# EAGLE design MRA12 (EAGLE 5.11)
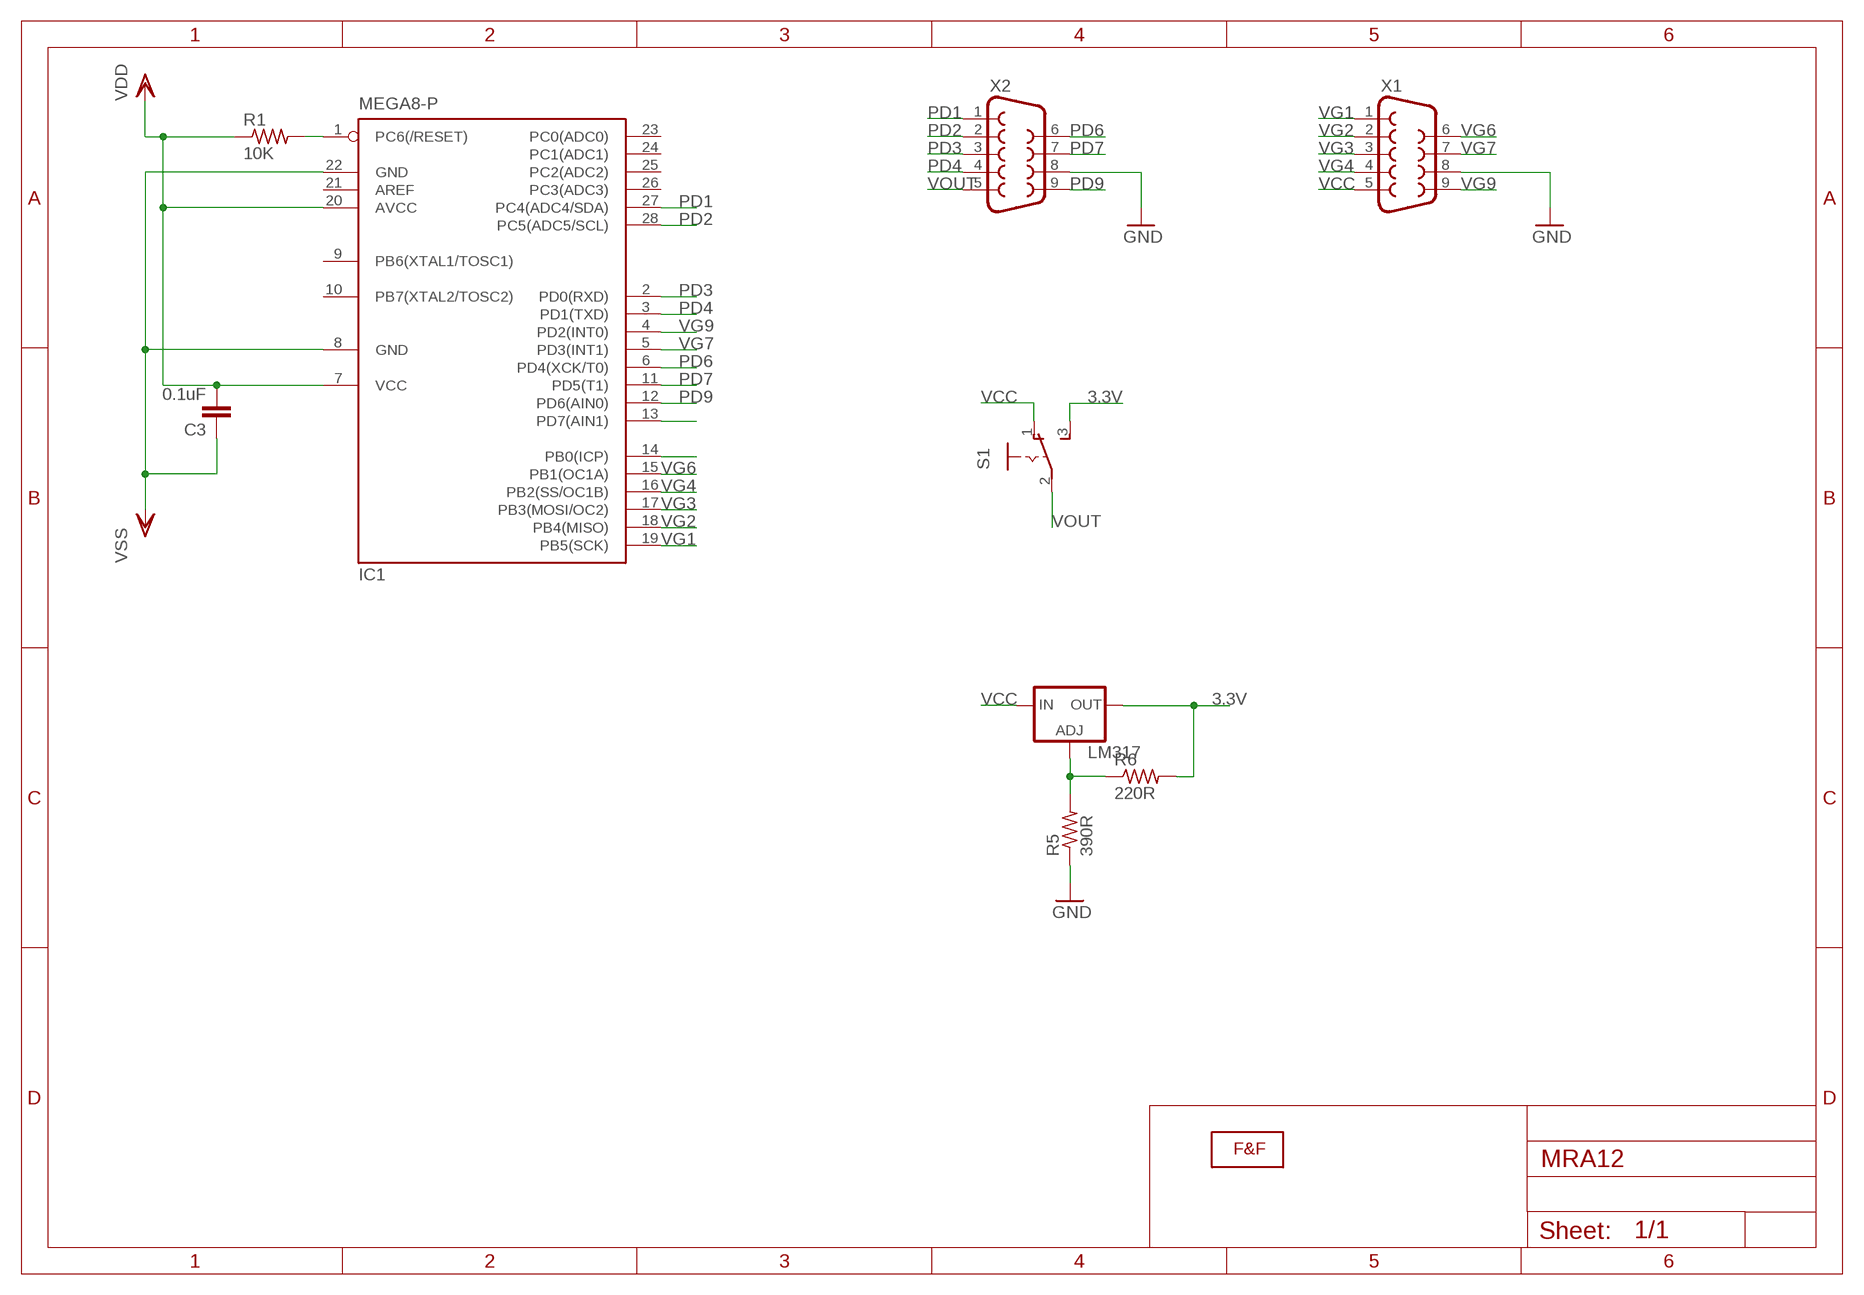
[diagram p0: schematic, sheet 1]

## Parts
C3  0.1uF  C-EU050-024X044  [C050-024X044]
IC1  MEGA8-P  [DIL28-3]
LM317  LM317TS  [317TS]
R1  10K  R-US_0207/10  [0207/10]
R5  390R  R-US_0207/10  [0207/10]
R6  220R  R-US_0207/10  [0207/10]
S1  CHAVE  [CHAVE]
U$1  LOGOLOGO_WITHOUT_SMOKE_SMALL  [LOGO2_SMALL]
X1  DB9MALE  [DB9_MALE]
X2  DB9MALE  [DB9_MALE]

## Nets
3.3V: LM317.2(OUT) R6.2 S1.3(S)
GND: C3.1 IC1.8(GND) IC1.22(GND) R5.1 X1.8 X2.8 ; supply symbol labelled VSS
N$1: IC1.1(PC6(/RESET)) R1.2
N$2: IC1.13(PD7(AIN1))
N$4: IC1.14(PB0(ICP))
N$5: LM317.1(ADJ) R5.2 R6.1
PD1: IC1.27(PC4(ADC4/SDA)) X2.1
PD2: IC1.28(PC5(ADC5/SCL)) X2.2
PD3: IC1.2(PD0(RXD)) X2.3
PD4: IC1.3(PD1(TXD)) X2.4
PD6: IC1.6(PD4(XCK/T0)) X2.6
PD7: IC1.11(PD5(T1)) X2.7
PD9: IC1.12(PD6(AIN0)) X2.9
VCC: LM317.3(IN) S1.1(O) X1.5
VG1: IC1.19(PB5(SCK)) X1.1
VG2: IC1.18(PB4(MISO)) X1.2
VG3: IC1.17(PB3(MOSI/OC2)) X1.3
VG4: IC1.16(PB2(SS/OC1B)) X1.4
VG6: IC1.15(PB1(OC1A)) X1.6
VG7: IC1.5(PD3(INT1)) X1.7
VG9: IC1.4(PD2(INT0)) X1.9
VOUT: C3.2 IC1.7(VCC) IC1.20(AVCC) R1.1 S1.2(P) X2.5 ; supply symbol labelled VDD
Unconnected: IC1.9(PB6(XTAL1/TOSC1)) IC1.10(PB7(XTAL2/TOSC2)) IC1.21(AREF) IC1.23(PC0(ADC0)) IC1.24(PC1(ADC1)) IC1.25(PC2(ADC2)) IC1.26(PC3(ADC3))

## Library data of the parts
C3 = rcl:C-EU: CAPACITOR, European symbol
IC1 = atmel:MEGA8-P: MICROCONTROLLER 8 Kbytes FLASH, 1 kbytes SRAM, 512 bytes EEPROM, USART, 4-channel 10 bit ADC, 2-channel 8 bit ADC Pin compatible with Atmega48, ATMega88, ATMega168 Source: avr.lbr; OC_FARNELL: unknown; OC_NEWARK: unknown
LM317 = v-reg:LM317TS: VOLTAGE REGULATOR
R1 R5 R6 = adafruit:R-US_: RESISTOR, American symbol
S1 = switch-fef:CHAVE: chave Verificar
U$1 = F&F:LOGO: Faísca e Fumaça Logo faiscaefumaca.com.br
X1 X2 = SparkFun:DB9: DB9 Connector Standard DB9 (D-Sub 9) serial connector. Can be used for CAN bus as well as RS485 and RS232. Footprint production proven. Spark Fun Electronics SKU : PRT-00429

## Board
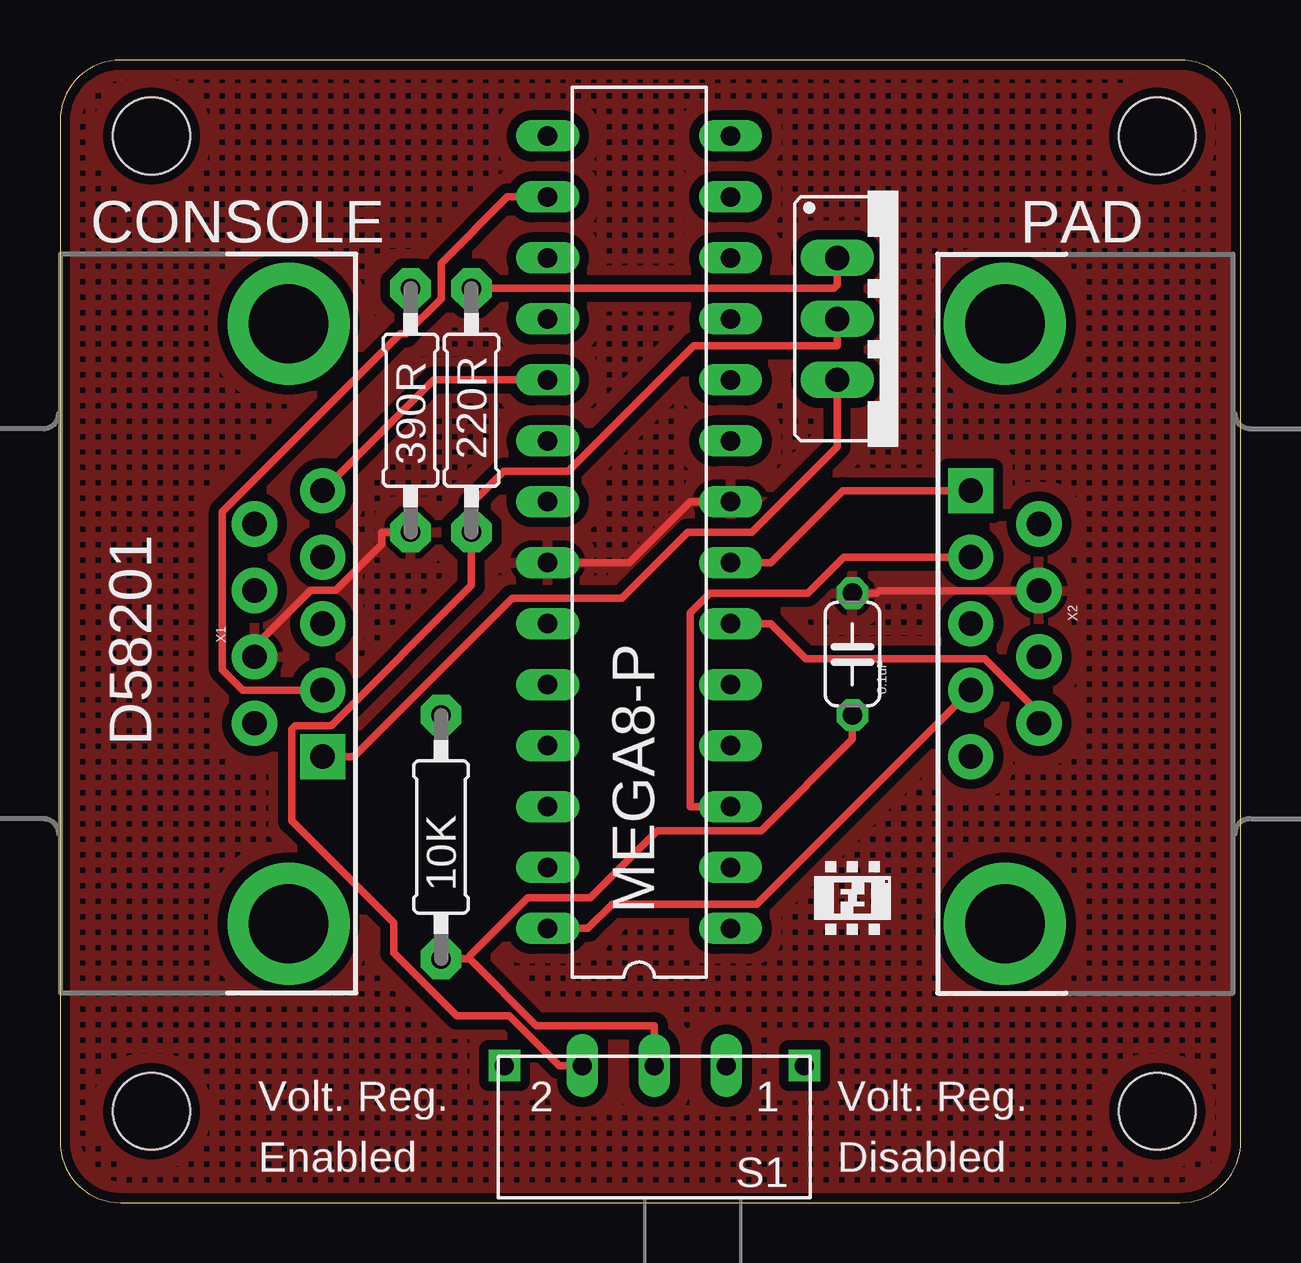
[diagram p1: board, top side]
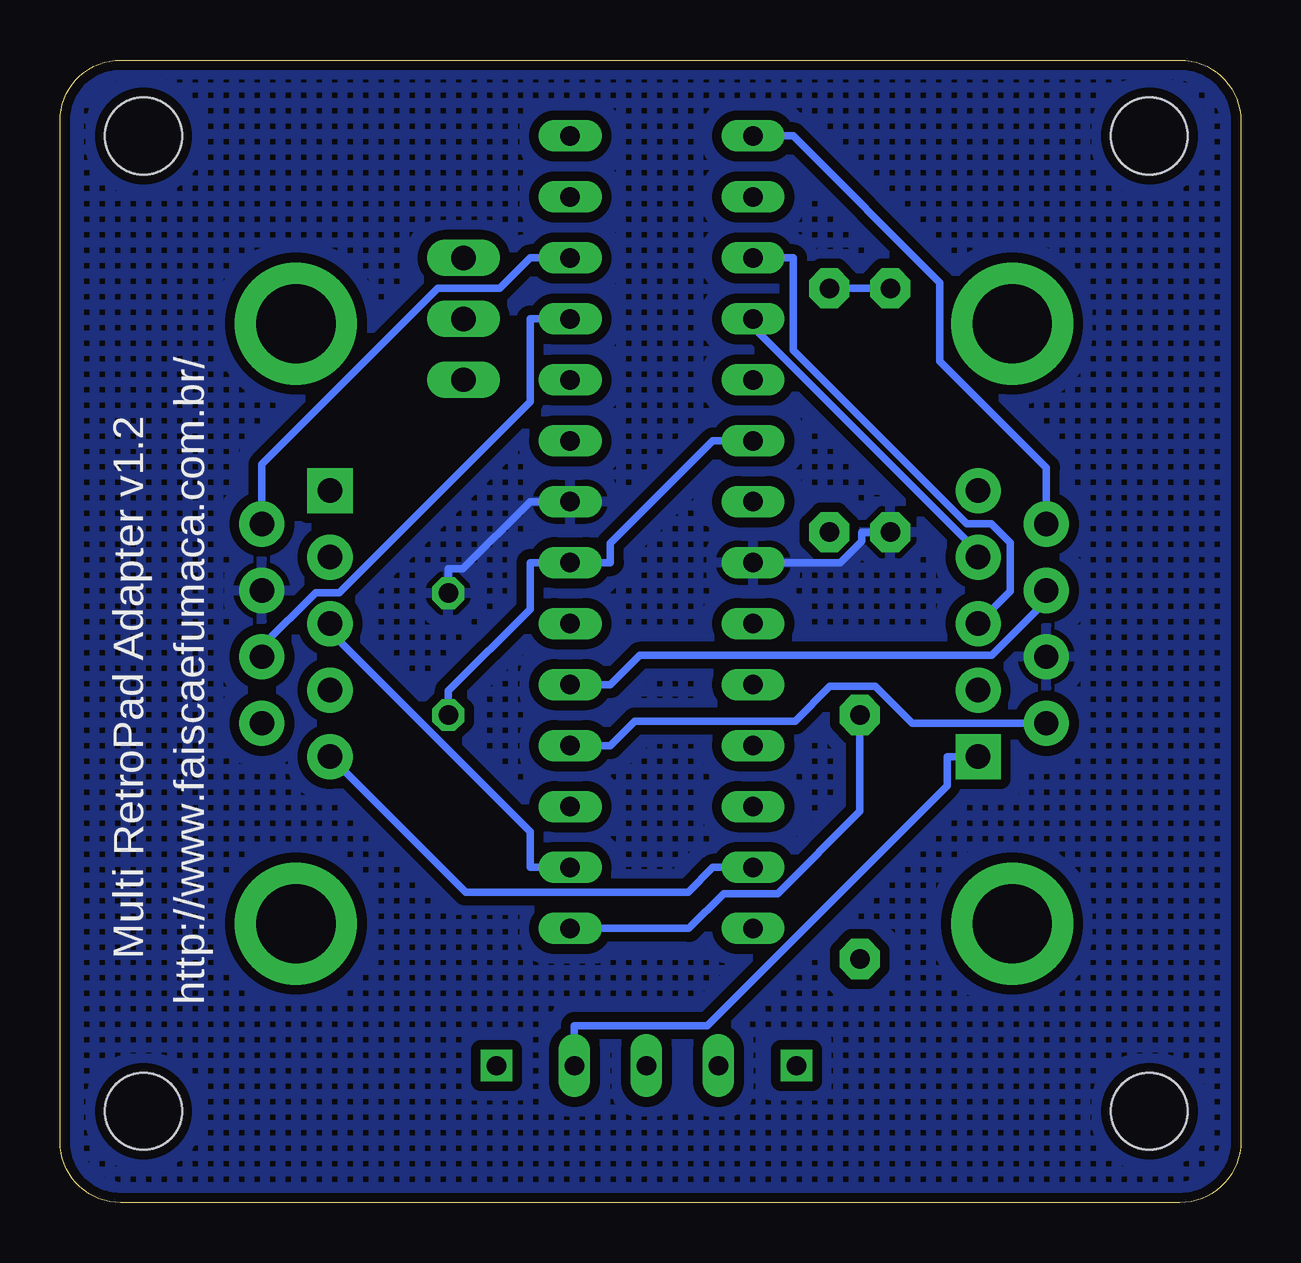
[diagram p2: board, bottom side, seen from below]

Size 49.2 x 47.62 mm. Coordinates in mm from the lower left corner, seen from the top.
Outline: 49.2,45.08 arc90 46.66,47.62 2.54,47.62 arc90 0,45.08 0,2.54 arc90 2.54,0 46.66,0 arc90 49.2,2.54 49.2,45.08
Copper layers (1*16): Top 0.035mm / dielectric 1.5mm / Bottom 0.035mm
Design rules "Fusion_eagle_rule_v1.1": minimum track width 6mil, minimum drill 12mil, track to track 6mil, track to pad 6mil, pad to pad 6mil, via to via 6mil, smd to smd 0mil, copper to edge 10mil, drill to drill 10mil, minimum pad ring 10mil, minimum via ring 6mil, stop-mask expansion 2mil, vias tented up to drill 100mil, thermal gap 10mil
Holes 3.2 mm at 3.81,44.45 3.81,3.81 45.72,44.45 45.72,3.81

### Footprints (pad centres in the part's own frame; a part is rotated, then mirrored left to right if it is on the bottom)
C050-024X044 = drill 0.813 octagon: 1 -2.54,0; 2 2.54,0
DIL28-3 = drill 0.813 long: 1 -16.51,-3.81; 2 -13.97,-3.81; 3 -11.43,-3.81; 4 -8.89,-3.81; 5 -6.35,-3.81; 6 -3.81,-3.81; 7 -1.27,-3.81; 8 1.27,-3.81; 9 3.81,-3.81; 10 6.35,-3.81; 11 8.89,-3.81; 12 11.43,-3.81; 13 13.97,-3.81; 14 16.51,-3.81; 15 16.51,3.81; 16 13.97,3.81; 17 11.43,3.81; 18 8.89,3.81; 19 6.35,3.81; 20 3.81,3.81; 21 1.27,3.81; 22 -1.27,3.81; 23 -3.81,3.81; 24 -6.35,3.81; 25 -8.89,3.81; 26 -11.43,3.81; 27 -13.97,3.81; 28 -16.51,3.81
317TS = drill 1.016 long: 1 -2.54,-2.54; 2 0,-2.54; 3 2.54,-2.54
0207/10 = drill 0.813 pad 1.676 octagon: 1 -5.08,0; 2 5.08,0
CHAVE = drill 0.8 long: 1 -3,0; 2 0,0; 3 3,0 | drill 0.8 square: P$1 -6.25,0; P$2 6.25,0
DB9_MALE = drill 1.016 pad 1.88 round: 1 5.54,-1.42; 2 2.77,-1.42; 3 0,-1.42; 4 -2.77,-1.42; 6 4.15,1.42; 7 1.38,1.42; 8 -1.38,1.42; 9 -4.15,1.42 | drill 1.016 pad 1.88 square: 5 -5.54,-1.42 | drill 3.302 pad 5.08 round: G1 -12.5,0; G2 12.5,0

### Placement (x,y rotation side)
C3  33.02,22.86 270 top
IC1  24.13,27.94 90 top
LM317  34.92,36.83 270 top
R1  15.88,15.24 90 top
R5  14.61,33.02 90 top
R6  17.14,33.02 270 top
S1  24.77,5.71 180 top
U$1  33.02,12.7 0 top
X1  9.53,24.13 90 top
X2  39.37,24.13 270 top

### Tracks (layer width: path | path; a pad name or v marks a point on that pad's centre or on a via)
3.3V
  Top 0.305: S1.3 20.8,5.71 18.73,7.79 16.54,7.79 13.9,10.43 13.9,11.66 9.65,15.91 9.65,19.72 9.81,19.89 11.31,19.89 17.14,25.73 R6.2 17.14,29.13 18.49,30.48 21.17,30.48 26.4,35.71 32.38,35.71 LM317.2
GND
  Top 0.305: IC1.8 26.26,29.21 23.72,26.67 IC1.22 | R5.1 13.41,27.94 13.41,27.45 11.48,25.52 10.44,25.52 8.11,23.18 X1.8 | C3.1 34.04,25.4 34.15,25.51 X2.8
  Bottom 0.305: R5.1 15.8,27.94 15.8,27.57 16.7,26.67 IC1.22 | C3.1 33.02,26.42 32.41,26.42 29.62,29.21 IC1.8
  pour Top (isolate 0.406, hatched): 0,48.26 49.53,48.26 49.53,0 0,0
  pour Bottom (isolate 0.406, hatched): 0,48.26 49.53,48.26 49.53,0 0,0
N$1
  Bottom 0.305: R1.2 15.88,16.31 19.3,12.88 21.55,12.88 23,11.43 IC1.1
N$5
  Top 0.305: LM317.1 32.38,38.25 32.23,38.1 R6.1
  Bottom 0.305: R5.2 R6.1
PD1
  Bottom 0.305: IC1.27 22,13.97 23.03,12.94 32.3,12.94 X2.1
PD2
  Top 0.305: IC1.28 22,11.43 23.01,12.45 29.04,12.45 X2.2
PD3
  Bottom 0.305: IC1.2 29.62,13.97 29.62,15.46 37.95,23.79 X2.3
PD4
  Top 0.305: IC1.3 26.26,16.51 26.26,24.58 27.08,25.4 31.15,25.4 32.65,26.9 X2.4
PD6
  Top 0.305: IC1.6 29.62,24.13 31.08,22.67 38.53,22.67 40.79,20.41 X2.6
PD7
  Bottom 0.305: IC1.11 29.62,36.83 29.62,33.38 37.57,25.43 38.55,25.43 40.79,23.18 X2.7
PD9
  Bottom 0.305: IC1.12 29.62,39.37 30.89,38.1 33.46,38.1 40.79,30.77 X2.9
VCC
  Top 0.305: LM317.3 32.38,31.49 28.83,27.94 26.16,27.94 23.41,25.19 18.84,25.19 12.24,18.59 X1.5
  Bottom 0.305: S1.1 27.77,7.38 22.24,7.38 12.24,17.38 12.24,18.59 X1.5
VG1
  Top 0.305: X1.1 15.56,34.29 IC1.19
VG2
  Bottom 0.305: X1.2 10.95,27.1 20.32,36.47 IC1.18
VG3
  Bottom 0.305: IC1.17 18.64,39.37 18.64,35.52 11.41,28.29 10.39,28.29 9.6,27.5 9.6,25.47 X1.3
VG4
  Top 0.305: IC1.16 18.64,41.91 15.88,39.14 15.88,37.67 14.41,36.2 14.17,36.2 6.76,28.8 6.76,22.22 7.62,21.36 X1.4
VG6
  Bottom 0.305: IC1.15 18.64,44.45 12.53,38.34 12.53,35.06 8.11,30.63 X1.6
VG7
  Bottom 0.305: IC1.5 26.26,21.59 25.05,22.8 10.38,22.8 8.11,25.08 X1.7
VG9
  Bottom 0.305: IC1.4 26.26,19.05 25.25,20.07 18.57,20.07 17.12,21.52 15.23,21.52 13.7,19.98 X1.9
VOUT
  Top 0.305: S1.2 24.77,7.38 19.85,7.38 17.07,10.16 | 17.07,10.16 R1.1 | C3.2 33.02,19.3 29.21,15.49 24.9,15.49 22.1,12.7 19.48,12.7 17.07,10.28 17.07,10.16 | IC1.7 29.62,26.67 32.62,29.67 36.65,29.67 X2.5
  Bottom 0.305: C3.2 | C3.2 33.02,21.34 29.62,24.74 29.62,26.67 IC1.7 26.26,26.67 26.26,27.48 22,31.75 IC1.20

### Text on the board
tPlace: CONSOLE | PAD | D58201 | Volt. Reg. | Volt. Reg. | Enabled | Disabled
bPlace: Multi RetroPad Adapter v1.2 | http://www.faiscaefumaca.com.br/